# Altium project ash-power.PrjPCB (part 2 of 2)

## Sheet aux_power.SchDoc: AUX supply
size A4; Organization: GPA Robotics; DocumentNumber: 10; Revision: REV 0; SheetNumber: 10; SheetTotal: 11
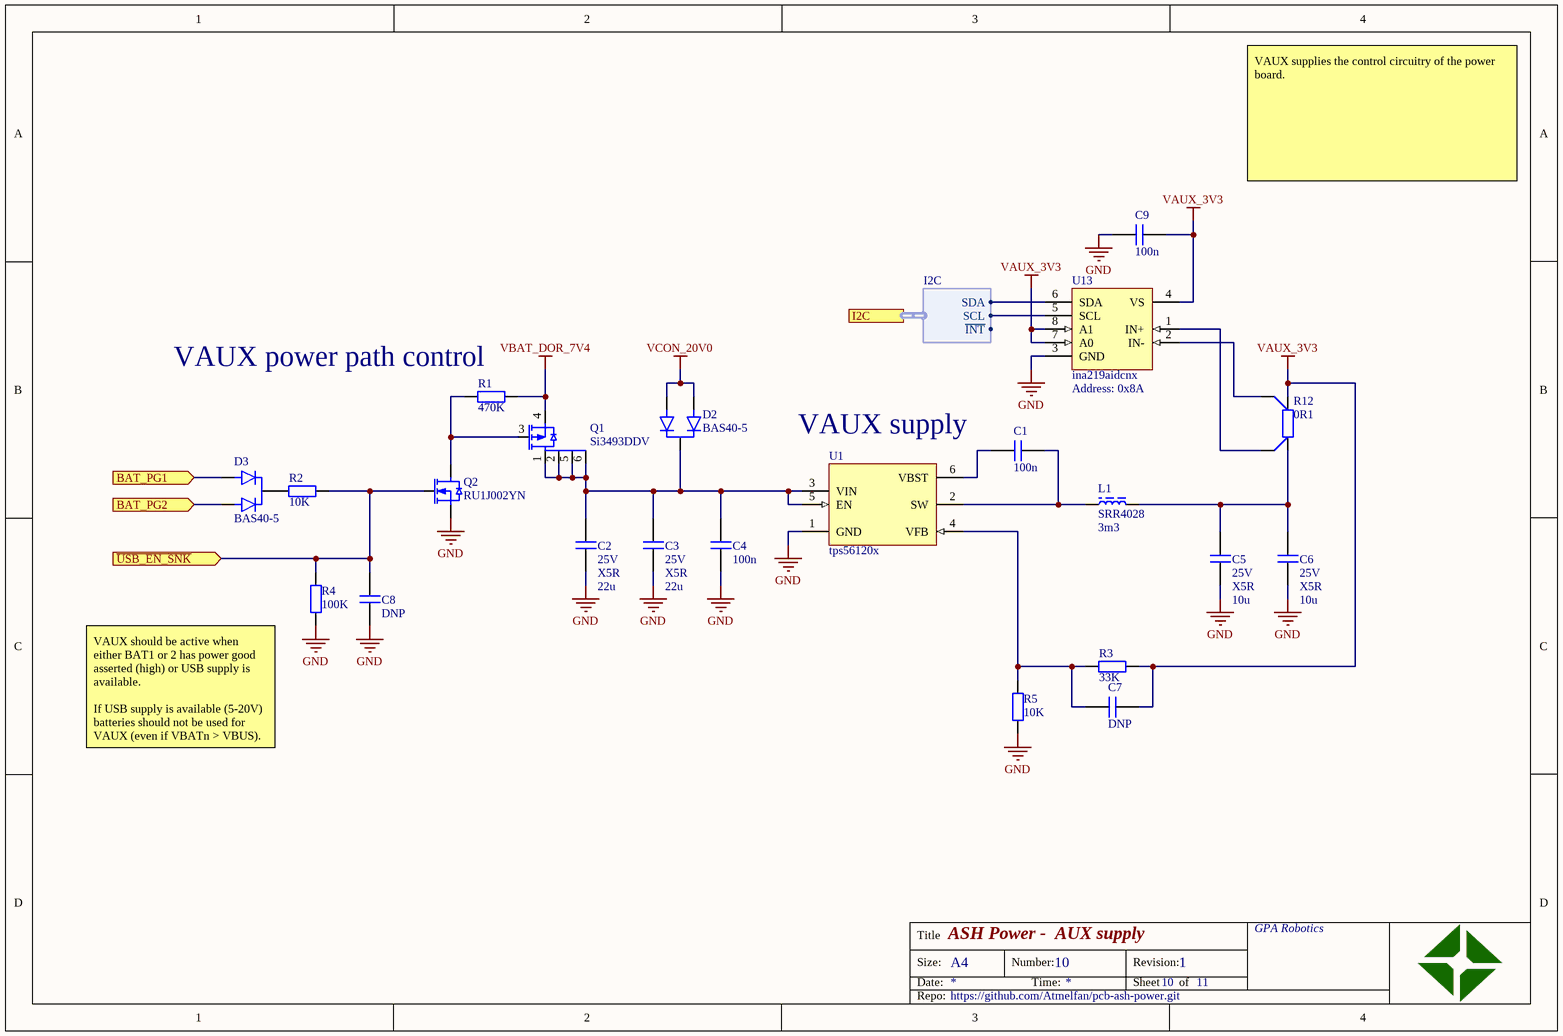
[diagram p9: aux_power.SchDoc]

### Parts
C1  value 100n  [CAPC1005X06N]  (hidden comment: cap)
C2  value 22u  voltage: 25V  type: X5R  [CAPC3216X14N]  (hidden comment: cap)
C3  value 22u  voltage: 25V  type: X5R  [CAPC3216X14N]  (hidden comment: cap)
C4  value 100n  [CAPC1005X06N]  (hidden comment: cap)
C5  value 10u  voltage: 25V  type: X5R  [CAPC3216X14N]  (hidden comment: cap)
C6  value 10u  voltage: 25V  type: X5R  [CAPC3216X14N]  (hidden comment: cap)
C7  value DNP  [CAPC1005X06N]  (hidden comment: cap)
C8  value DNP  [CAPC1005X06N]  (hidden comment: cap)
C9  value 100n  [CAPC1005X06N]  (hidden comment: cap)
D2  BAS40-5  [SOT23_CC]
D3  BAS40-5  [SOT23_CC]
L1  SRR4028  value 3m3  [SRR4028]
Q1  Si3493DDV  [SOT95P284X110-6N_TSOP6]
Q2  RU1J002YN  [SOTFL65P210X105-3N]
R1  value 470K  [RESC1005X04N]  (hidden comment: res)
R2  value 10K  [RESC1005X04N]  (hidden comment: res)
R3  value 33K  [RESC1005X04N]  (hidden comment: res)
R4  value 100K  [RESC1005X04N]  (hidden comment: res)
R5  value 10K  [RESC1005X04N]  (hidden comment: res)
R12  value 0R1  [RESC2012X06N_4T]  (hidden comment: res_4t)
U1  tps56120x  [SOT95P280X110-6N]
U13  ina219aidcnx  Address: 0x8A  [TSOP65P280X145-8N]

### Ports
BAT_PG1 (in), BAT_PG2 (in), I2C (harness I2C), ~{USB_EN_SNK} (in)

### Harnesses
I2C: SDA, SCL, ~{INT}

### Nets
GND: C2.1 C3.1 C4.1 C5.1 C6.1 C8.1 C9.2 Q2.2(S) R4.1 R5.1 U1.1(GND) U13.3(GND)
VAUX_3V3: C7.2 C9.1 R3.2 R12.1 U13.4(VS) U13.7(A0) U13.8(A1)
VBAT_DOR_7V4: Q1.4(S) R1.2
VCON_20V0: D2.A1 D2.A2  [project net VBUS]
NetC1_1: C1.1 U1.6(VBST)
NetC1_2: C1.2 L1.1 U1.2(SW)
NetC2_2: C2.2 C3.2 C4.2 D2.C Q1.1(D) Q1.2(D) Q1.5(D) Q1.6(D) U1.3(VIN) U1.5(EN)
NetC5_2: C5.2 C6.2 L1.2 R12.2
NetC7_1: C7.1 R3.1 R5.2 U1.4(VFB)
NetC8_2: C8.2 Q2.1(G) R2.2 R4.2 ; port ~{USB_EN_SNK}
NetD3_A1: D3.A1 ; port BAT_PG1
NetD3_A2: D3.A2 ; port BAT_PG2
NetD3_C: D3.C R2.1
NetID3_CONTROL_POW_LEG_L_LEG1_2: U13.5(SCL) ; port I2C.SCL
NetID4_CONTROL_POW_LEG_L_LEG1_2: U13.6(SDA) ; port I2C.SDA
NetQ1_3: Q1.3(G) Q2.3(D) R1.1
NetR12_3: R12.3 U13.2(IN-)
NetR12_4: R12.4 U13.1(IN+)

### Notes on the sheet
- VAUX supplies the control circuitry of the power board.
- (near R1) VAUX power path control
- VAUX supply
- (near R4) VAUX should be active when either BAT1 or 2 has power good asserted (high) or USB supply is available.
  If USB supply is available (5-20V) batteries should not be used for VAUX (even if VBATn > VBUS).
- Title
- Size:
- Date:
- A4
- Number:
- Time:
- Revision:
- Sheet
- of
- Repo:

### Library data of the parts
C1-C9 = cap: Capacitor; #digikey: *; #mouser: *
  C1 C4 C7-C9: voltage: *; type: *
D2 D3 = diode_dual_cc: Diode Common Cathode
Q1 = si3493ddv: P-Channel 20 V (D-S) MOSFET; ComponentLink1Description: datasheet; ComponentLink1URL: http://www.vishay.com/docs/62839/si7149adp.pdf
Q2 = ru1j002yn: N-channel 50V 200mA Small signal MOSFET; ComponentLink1Description: datasheet; ComponentLink1URL: https://www.mouser.se/datasheet/2/348/ru1j002yn-e-1018335.pdf
R1-R5 = res: Resistor; power: *; voltage: *; #digikey: *; #mouser: *
R12 = res_4t: Resistor; power: *; #digikey: *; #mouser: *
U1 = tps56120x: 4.5-V to 17-V Input, 1-A Synchronous  Step-Down  Voltage  Regulator  in 6-Pin  SOT-23; #digikey: *; #mouser: *
U13 = ina219aidcnx: INA219 Zero-Drift, Bidirectional Current/Power Monitor With I2C Interface; ComponentLink1Description: Datasheet; ComponentLink1URL: https://www.ti.com/lit/ds/symlink/ina219.pdf?&ts=1589650364826; Supplier 1: Digi-Key; Supplier Part Number 1: 296-23770-1-ND
L1 = srr4028: ComponentLink1Description: series; ComponentLink1URL: https://www.bourns.com/docs/Product-Datasheets/SRR4028.pdf

## Sheet servos.SchDoc: Eye servos
size A4; Organization: GPA Robotics; DocumentNumber: 3; Revision: REV 0; SheetNumber: 3; SheetTotal: 11
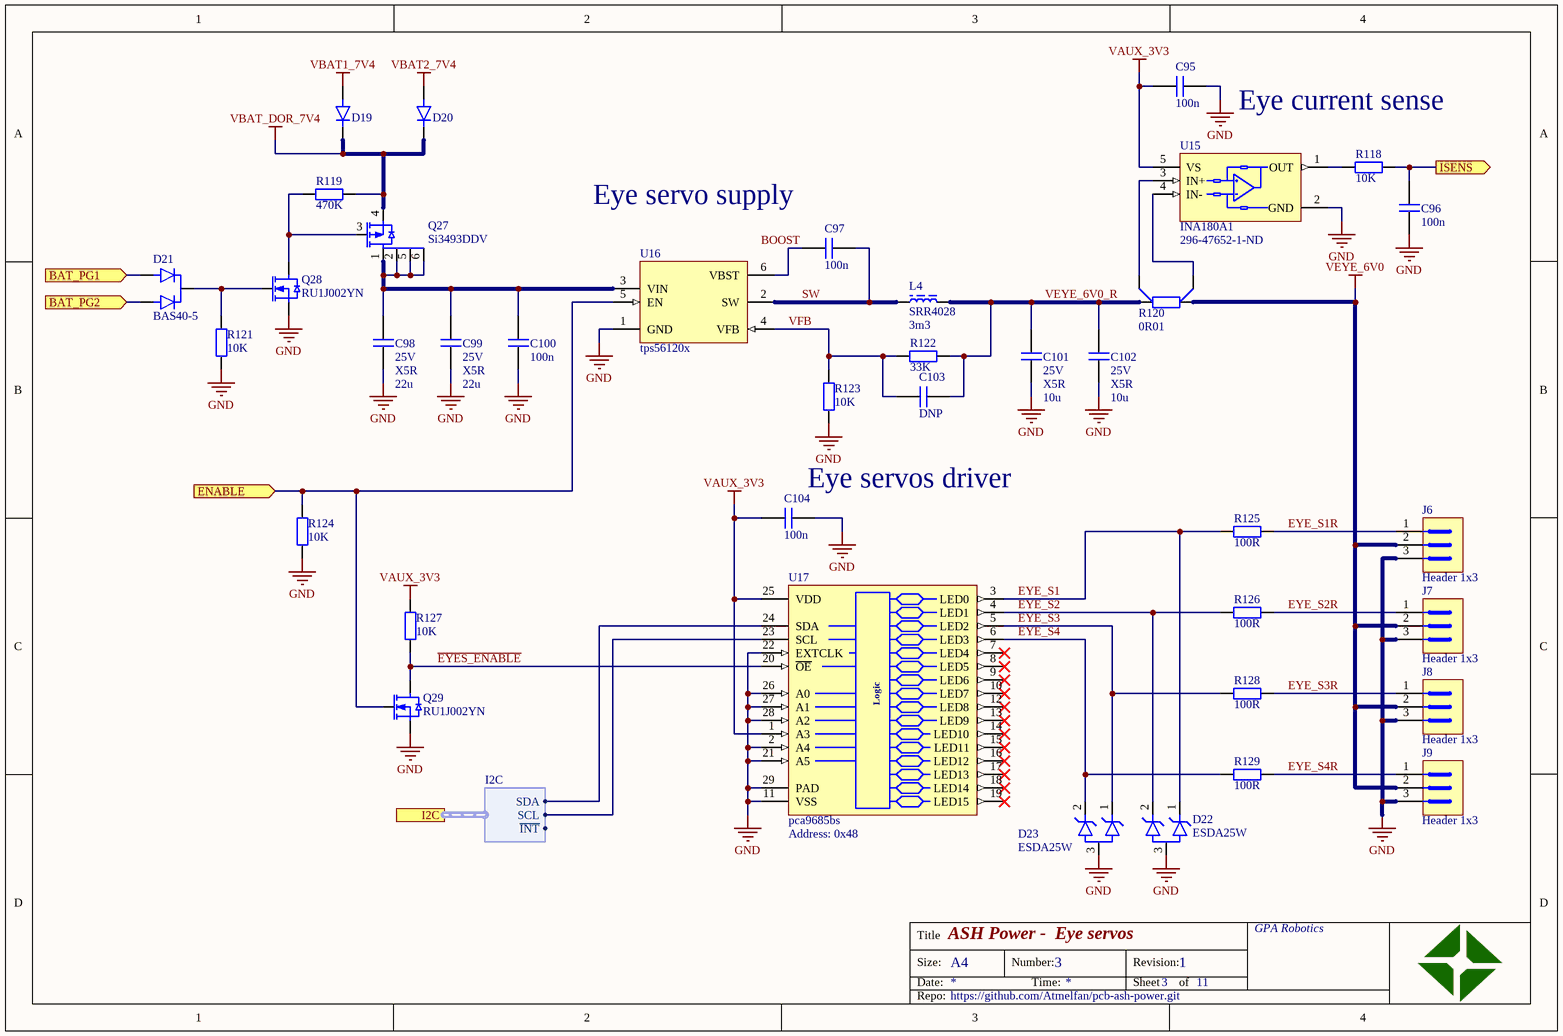
[diagram p10: servos.SchDoc]

### Parts
C95  value 100n  [CAPC1005X06N]  (hidden comment: cap)
C96  value 100n  [CAPC1005X06N]  (hidden comment: cap)
C97  value 100n  [CAPC1005X06N]  (hidden comment: cap)
C98  value 22u  voltage: 25V  type: X5R  [CAPC3216X14N]  (hidden comment: cap)
C99  value 22u  voltage: 25V  type: X5R  [CAPC3216X14N]  (hidden comment: cap)
C100  value 100n  [CAPC1005X06N]  (hidden comment: cap)
C101  value 10u  voltage: 25V  type: X5R  [CAPC3216X14N]  (hidden comment: cap)
C102  value 10u  voltage: 25V  type: X5R  [CAPC3216X14N]  (hidden comment: cap)
C103  value DNP  [CAPC1005X06N]  (hidden comment: cap)
C104  value 100n  [CAPC1005X06N]  (hidden comment: cap)
D19  DFLS2100  [SODFL370X100-2N_DFLS2100]  (value not drawn)
D20  DFLS2100  [SODFL370X100-2N_DFLS2100]  (value not drawn)
D21  BAS40-5  [SOT23_CC]
D22  ESDA25W  [SOT65P210X110-3N_SOT323-3L]
D23  ESDA25W  [SOT65P210X110-3N_SOT323-3L]
J6  Header 1x3  [HEADER_1x3_100MIL]
J7  Header 1x3  [HEADER_1x3_100MIL]
J8  Header 1x3  [HEADER_1x3_100MIL]
J9  Header 1x3  [HEADER_1x3_100MIL]
L4  SRR4028  value 3m3  [SRR4028]
Q27  Si3493DDV  [SOT95P284X110-6N_TSOP6]
Q28  RU1J002YN  [SOTFL65P210X105-3N]
Q29  RU1J002YN  [SOTFL65P210X105-3N]
R118  value 10K  [RESC1005X04N]  (hidden comment: res)
R119  value 470K  [RESC1005X04N]  (hidden comment: res)
R120  value 0R01  [4T_RESC1632X05N]  (hidden comment: res_4t)
R121  value 10K  [RESC1005X04N]  (hidden comment: res)
R122  value 33K  [RESC1005X04N]  (hidden comment: res)
R123  value 10K  [RESC1005X04N]  (hidden comment: res)
R124  value 10K  [RESC1005X04N]  (hidden comment: res)
R125  value 100R  [RESC1005X04N]  (hidden comment: res)
R126  value 100R  [RESC1005X04N]  (hidden comment: res)
R127  value 10K  [RESC1005X04N]  (hidden comment: res)
R128  value 100R  [RESC1005X04N]  (hidden comment: res)
R129  value 100R  [RESC1005X04N]  (hidden comment: res)
U15  INA180A1  Supplier Part Number 1: 296-47652-1-ND  [SOT95P280X145-5N]
U16  tps56120x  [SOT95P280X110-6N]
U17  pca9685bs  Address: 0x48  [QFN65P600X600X100_HS-29N_PCA9685BS]

### Ports
BAT_PG1 (in), BAT_PG2 (in), ENABLE (in), I2C (harness I2C), ISENS (out)

### Harnesses
I2C: SDA, SCL, ~{INT}

### Nets
GND: C95.1 C96.1 C98.1 C99.1 C100.1 C101.1 C102.1 C104.2 D22.3 D23.3 J6.3 J7.3 J8.3 J9.3 Q28.2(S) Q29.2(S) R121.1 R123.1 R124.1 U15.2(GND) U16.1(GND) U17.2(A4) U17.11(VSS) U17.21(A5) U17.22(EXTCLK) U17.26(A0) U17.27(A1) U17.28(A2) U17.29(PAD)
VAUX_3V3: C95.2 C104.1 R127.2 U15.5(VS) U17.1(A3) U17.25(VDD)
VBAT1_7V4: D19.A
VBAT2_7V4: D20.A
VBAT_DOR_7V4: D19.C D20.C Q27.4(S) R119.2
VEYE_6V0: J6.2 J7.2 J8.2 J9.2 R120.2
~{EYES_ENABLE}: Q29.3(D) R127.1 U17.20(~{OE})
BOOST: C97.1 U16.6(VBST)
EYE_S1: D22.1 R125.1 U17.3(LED0)
EYE_S1R: J6.1 R125.2
EYE_S2: D22.2 R126.1 U17.4(LED1)
EYE_S2R: J7.1 R126.2
EYE_S3: D23.1 R128.1 U17.5(LED2)
EYE_S3R: J8.1 R128.2
EYE_S4: D23.2 R129.1 U17.6(LED3)
EYE_S4R: J9.1 R129.2
SW: C97.2 L4.1 U16.2(SW)
VEYE_6V0_R: C101.2 C102.2 C103.2 L4.2 R120.1 R122.2
VFB: C103.1 R122.1 R123.2 U16.4(VFB)
NetC96_2: C96.2 R118.2 ; port ISENS
NetC98_2: C98.2 C99.2 C100.2 Q27.1(D) Q27.2(D) Q27.5(D) Q27.6(D) U16.3(VIN)
NetD3_A1: D21.A1 ; port BAT_PG1
NetD3_A2: D21.A2 ; port BAT_PG2
NetD21_C: D21.C Q28.1(G) R121.2
NetID3_CONTROL_POW_LEG_L_LEG1_2: U17.23(SCL) ; port I2C.SCL
NetID4_CONTROL_POW_LEG_L_LEG1_2: U17.24(SDA) ; port I2C.SDA
NetQ27_3: Q27.3(G) Q28.3(D) R119.1
NetQ29_1: Q29.1(G) R124.2 U16.5(EN) ; port ENABLE
NetR118_1: R118.1 U15.1(OUT)
NetR120_3: R120.3 U15.3(IN+)
NetR120_4: R120.4 U15.4(IN-)

Not connected (* = marked no-connect by the designer): U17 7(LED4)* 8(LED5)* 9(LED6)* 10(LED7)* 12(LED8)* 13(LED9)* 14(LED10)* 15(LED11)* 16(LED12)* 17(LED13)* 18(LED14)* 19(LED15)*

### Notes on the sheet
- Eye current sense
- Eye servo supply
- (near C104) Eye servos driver
- Title
- Size:
- Date:
- A4
- Number:
- Time:
- Revision:
- Sheet
- of
- Repo:
- (in symbol pca9685bs) Logic

### Library data of the parts
C95-C104 = cap: Capacitor; #digikey: *; #mouser: *
  C95-C97 C100 C103 C104: voltage: *; type: *
D19 D20 = dfls2100: 2.0A HIGH VOLTAGE SCHOTTKY BARRIER RECTIFIER; ComponentLink1Description: datasheet; ComponentLink1URL: https://www.diodes.com/assets/Datasheets/ds31475.pdf
D21 = diode_dual_cc: Diode Common Cathode
D22 D23 = esda25w: TRANSIL array for data protection; ComponentLink1Description: datasheet; ComponentLink1URL: https://www.st.com/content/ccc/resource/technical/document/datasheet/cd/9b/8d/39/1f/d4/43/ba/CD00064033.pdf/files/CD00064033.pdf/jcr:content/translations/en.CD00064033.pdf
J6-J9 = header_1x3_100mil: 2.54mm pitch single row header
Q27 = si3493ddv: P-Channel 20 V (D-S) MOSFET; ComponentLink1Description: datasheet; ComponentLink1URL: http://www.vishay.com/docs/62839/si7149adp.pdf
Q28 Q29 = ru1j002yn: N-channel 50V 200mA Small signal MOSFET; ComponentLink1Description: datasheet; ComponentLink1URL: https://www.mouser.se/datasheet/2/348/ru1j002yn-e-1018335.pdf
R118 R119 R121-R129 = res: Resistor; power: *; voltage: *; #digikey: *; #mouser: *
R120 = res_4t: Resistor; power: *; #digikey: *; #mouser: *
U15 = ina180a1: Low- and High-Side Voltage Output, Current-Sense Amplifiers; Datasheet: http://www.ti.com/lit/ds/symlink/ina180.pdf; #digikey: *; #mouser: *; Supplier 1: Digi-Key
U16 = tps56120x: 4.5-V to 17-V Input, 1-A Synchronous  Step-Down  Voltage  Regulator  in 6-Pin  SOT-23; #digikey: *; #mouser: *
U17 = pca9685bs: 16-channel, 12-bit PWM Fm+ I2C-bus LED controller; ComponentLink1Description: datasheet; ComponentLink1URL: https://www.nxp.com/docs/en/data-sheet/PCA9685.pdf
L4 = srr4028: ComponentLink1Description: series; ComponentLink1URL: https://www.bourns.com/docs/Product-Datasheets/SRR4028.pdf

## Nets that join several sheets
GND: cover (6 pins), control (23 pins), power (17 pins), ext_power (18 pins), CONTROL/POW/HS_R (16 pins), CONTROL/POW/HS_L (16 pins), usbpd_input (16 pins), CONTROL/POW/LEG_R (JG1_LEG_R.2 JG2_LEG_R.2), CONTROL/POW/LEG_R/LEG1 (25 pins), CONTROL/POW/LEG_R/LEG2 (25 pins), CONTROL/POW/LEG_R/LEG3 (25 pins), CONTROL/POW/LEG_R/LEG4 (25 pins), CONTROL/POW/LEG_L (JG1_LEG_L.2 JG2_LEG_L.2), CONTROL/POW/LEG_L/LEG1 (25 pins), CONTROL/POW/LEG_L/LEG2 (25 pins), CONTROL/POW/LEG_L/LEG3 (25 pins), CONTROL/POW/LEG_L/LEG4 (25 pins), CONTROL/POW/REG_R (29 pins), CONTROL/POW/REG_L (29 pins), aux_power (12 pins), servos (29 pins)
VAUX_3V3: control (21 pins), power (6 pins), CONTROL/POW/LEG_R/LEG1 (11 pins), CONTROL/POW/LEG_R/LEG2 (11 pins), CONTROL/POW/LEG_R/LEG3 (11 pins), CONTROL/POW/LEG_R/LEG4 (11 pins), CONTROL/POW/LEG_L/LEG1 (11 pins), CONTROL/POW/LEG_L/LEG2 (11 pins), CONTROL/POW/LEG_L/LEG3 (11 pins), CONTROL/POW/LEG_L/LEG4 (11 pins), CONTROL/POW/REG_R (C78_REG_R.2 R10_REG_R.2 U2_REG_R.4), CONTROL/POW/REG_L (C78_REG_L.2 R10_REG_L.2 U2_REG_L.4), aux_power (7 pins), servos (6 pins)
VBAT1_7V4: power (P2.1 R13.1), servos (D19.A)
VBAT2_7V4: power (P3.1 R15.1), servos (D20.A)
VBAT_DOR_7V4: aux_power (Q1.4 R1.2), servos (D19.C D20.C Q27.4 R119.2)
VBUS: usbpd_input (11 pins), aux_power (D2.A1 D2.A2)
NetC105_REG_L_1: CONTROL/POW/LEG_R/LEG1 (U6_CONTROL_POW_LEG_R_LEG1.17), CONTROL/POW/LEG_R/LEG2 (U6_CONTROL_POW_LEG_R_LEG2.17), CONTROL/POW/LEG_R/LEG3 (U6_CONTROL_POW_LEG_R_LEG3.17), CONTROL/POW/LEG_R/LEG4 (U6_CONTROL_POW_LEG_R_LEG4.17), CONTROL/POW/LEG_L/LEG1 (U6_CONTROL_POW_LEG_L_LEG1.17), CONTROL/POW/LEG_L/LEG2 (U6_CONTROL_POW_LEG_L_LEG2.17), CONTROL/POW/LEG_L/LEG3 (U6_CONTROL_POW_LEG_L_LEG3.17), CONTROL/POW/LEG_L/LEG4 (U6_CONTROL_POW_LEG_L_LEG4.17), CONTROL/POW/REG_R (C105_REG_R.1 R108_REG_R.2 U14_REG_R.17), CONTROL/POW/REG_L (C105_REG_L.1 R108_REG_L.2 U14_REG_L.17)
NetD3_A1: aux_power (D3.A1), servos (D21.A1)
NetD3_A2: aux_power (D3.A2), servos (D21.A2)
NetD12_A2: ext_power (D12.A2 R7.1 U10.8), usbpd_input (U12.14)
NetID3_CONTROL_POW_LEG_L_LEG1_2: power (U9.13), usbpd_input (U12.7), CONTROL/POW/LEG_R/LEG1 (ID3_CONTROL_POW_LEG_R_LEG1.2 U7_CONTROL_POW_LEG_R_LEG1.8 U8_CONTROL_POW_LEG_R_LEG1.6), CONTROL/POW/LEG_R/LEG2 (ID3_CONTROL_POW_LEG_R_LEG2.2 U7_CONTROL_POW_LEG_R_LEG2.8 U8_CONTROL_POW_LEG_R_LEG2.6), CONTROL/POW/LEG_R/LEG3 (ID3_CONTROL_POW_LEG_R_LEG3.2 U7_CONTROL_POW_LEG_R_LEG3.8 U8_CONTROL_POW_LEG_R_LEG3.6), CONTROL/POW/LEG_R/LEG4 (ID3_CONTROL_POW_LEG_R_LEG4.2 U7_CONTROL_POW_LEG_R_LEG4.8 U8_CONTROL_POW_LEG_R_LEG4.6), CONTROL/POW/LEG_L/LEG1 (ID3_CONTROL_POW_LEG_L_LEG1.2 U7_CONTROL_POW_LEG_L_LEG1.8 U8_CONTROL_POW_LEG_L_LEG1.6), CONTROL/POW/LEG_L/LEG2 (ID3_CONTROL_POW_LEG_L_LEG2.2 U7_CONTROL_POW_LEG_L_LEG2.8 U8_CONTROL_POW_LEG_L_LEG2.6), CONTROL/POW/LEG_L/LEG3 (ID3_CONTROL_POW_LEG_L_LEG3.2 U7_CONTROL_POW_LEG_L_LEG3.8 U8_CONTROL_POW_LEG_L_LEG3.6), CONTROL/POW/LEG_L/LEG4 (ID3_CONTROL_POW_LEG_L_LEG4.2 U7_CONTROL_POW_LEG_L_LEG4.8 U8_CONTROL_POW_LEG_L_LEG4.6), CONTROL/POW/REG_R (U2_REG_R.5), CONTROL/POW/REG_L (U2_REG_L.5), aux_power (U13.5), servos (U17.23)
NetID4_CONTROL_POW_LEG_L_LEG1_2: power (U9.12), usbpd_input (U12.8), CONTROL/POW/LEG_R/LEG1 (ID4_CONTROL_POW_LEG_R_LEG1.2 U7_CONTROL_POW_LEG_R_LEG1.9 U8_CONTROL_POW_LEG_R_LEG1.7), CONTROL/POW/LEG_R/LEG2 (ID4_CONTROL_POW_LEG_R_LEG2.2 U7_CONTROL_POW_LEG_R_LEG2.9 U8_CONTROL_POW_LEG_R_LEG2.7), CONTROL/POW/LEG_R/LEG3 (ID4_CONTROL_POW_LEG_R_LEG3.2 U7_CONTROL_POW_LEG_R_LEG3.9 U8_CONTROL_POW_LEG_R_LEG3.7), CONTROL/POW/LEG_R/LEG4 (ID4_CONTROL_POW_LEG_R_LEG4.2 U7_CONTROL_POW_LEG_R_LEG4.9 U8_CONTROL_POW_LEG_R_LEG4.7), CONTROL/POW/LEG_L/LEG1 (ID4_CONTROL_POW_LEG_L_LEG1.2 U7_CONTROL_POW_LEG_L_LEG1.9 U8_CONTROL_POW_LEG_L_LEG1.7), CONTROL/POW/LEG_L/LEG2 (ID4_CONTROL_POW_LEG_L_LEG2.2 U7_CONTROL_POW_LEG_L_LEG2.9 U8_CONTROL_POW_LEG_L_LEG2.7), CONTROL/POW/LEG_L/LEG3 (ID4_CONTROL_POW_LEG_L_LEG3.2 U7_CONTROL_POW_LEG_L_LEG3.9 U8_CONTROL_POW_LEG_L_LEG3.7), CONTROL/POW/LEG_L/LEG4 (ID4_CONTROL_POW_LEG_L_LEG4.2 U7_CONTROL_POW_LEG_L_LEG4.9 U8_CONTROL_POW_LEG_L_LEG4.7), CONTROL/POW/REG_R (U2_REG_R.6), CONTROL/POW/REG_L (U2_REG_L.6), aux_power (U13.6), servos (U17.24)
NetQ11_HS_L_5: CONTROL/POW/HS_R (9 pins), CONTROL/POW/HS_L (9 pins)
NetQ13_HS_L_3: CONTROL/POW/HS_R (Q13_HS_R.3 R50_HS_R.1 R52_HS_R.2 U5_HS_R.8), CONTROL/POW/HS_L (Q13_HS_L.3 R50_HS_L.1 R52_HS_L.2 U5_HS_L.8)
NetQ14_HS_L_5: CONTROL/POW/HS_R (7 pins), CONTROL/POW/HS_L (7 pins)
NetQ24_1: power (U9.3), usbpd_input (Q24.1)
NetR58_HS_L_1: CONTROL/POW/HS_R (R58_HS_R.1 U5_HS_R.17), CONTROL/POW/HS_L (R58_HS_L.1 U5_HS_L.17)
NetR103_2: power (U9.11), usbpd_input (R103.2), CONTROL/POW/LEG_R/LEG1 (U8_CONTROL_POW_LEG_R_LEG1.9), CONTROL/POW/LEG_R/LEG2 (U8_CONTROL_POW_LEG_R_LEG2.9), CONTROL/POW/LEG_R/LEG3 (U8_CONTROL_POW_LEG_R_LEG3.9), CONTROL/POW/LEG_R/LEG4 (U8_CONTROL_POW_LEG_R_LEG4.9), CONTROL/POW/LEG_L/LEG1 (U8_CONTROL_POW_LEG_L_LEG1.9), CONTROL/POW/LEG_L/LEG2 (U8_CONTROL_POW_LEG_L_LEG2.9), CONTROL/POW/LEG_L/LEG3 (U8_CONTROL_POW_LEG_L_LEG3.9), CONTROL/POW/LEG_L/LEG4 (U8_CONTROL_POW_LEG_L_LEG4.9)
NetU5_HS_L_11: CONTROL/POW/HS_R (U5_HS_R.11), CONTROL/POW/HS_L (U5_HS_L.11)
NetU5_HS_L_18: CONTROL/POW/HS_R (U5_HS_R.18), CONTROL/POW/HS_L (U5_HS_L.18)
NetU8_CONTROL_POW_LEG_L_LEG1_8: CONTROL/POW/LEG_R/LEG1 (U8_CONTROL_POW_LEG_R_LEG1.8 U8_CONTROL_POW_LEG_R_LEG1.10), CONTROL/POW/LEG_R/LEG2 (U8_CONTROL_POW_LEG_R_LEG2.8 U8_CONTROL_POW_LEG_R_LEG2.10), CONTROL/POW/LEG_R/LEG3 (U8_CONTROL_POW_LEG_R_LEG3.8 U8_CONTROL_POW_LEG_R_LEG3.10), CONTROL/POW/LEG_R/LEG4 (U8_CONTROL_POW_LEG_R_LEG4.8 U8_CONTROL_POW_LEG_R_LEG4.10), CONTROL/POW/LEG_L/LEG1 (U8_CONTROL_POW_LEG_L_LEG1.8 U8_CONTROL_POW_LEG_L_LEG1.10), CONTROL/POW/LEG_L/LEG2 (U8_CONTROL_POW_LEG_L_LEG2.8 U8_CONTROL_POW_LEG_L_LEG2.10), CONTROL/POW/LEG_L/LEG3 (U8_CONTROL_POW_LEG_L_LEG3.8 U8_CONTROL_POW_LEG_L_LEG3.10), CONTROL/POW/LEG_L/LEG4 (U8_CONTROL_POW_LEG_L_LEG4.8 U8_CONTROL_POW_LEG_L_LEG4.10)
NetU14_REG_L_9: CONTROL/POW/REG_R (U14_REG_R.9), CONTROL/POW/REG_L (U14_REG_L.9)
NetU18_CONTROL_POW_LEG_L_LEG1_2: CONTROL/POW/LEG_R/LEG1 (U18_CONTROL_POW_LEG_R_LEG1.2), CONTROL/POW/LEG_R/LEG2 (U18_CONTROL_POW_LEG_R_LEG2.2), CONTROL/POW/LEG_R/LEG3 (U18_CONTROL_POW_LEG_R_LEG3.2), CONTROL/POW/LEG_R/LEG4 (U18_CONTROL_POW_LEG_R_LEG4.2), CONTROL/POW/LEG_L/LEG1 (U18_CONTROL_POW_LEG_L_LEG1.2), CONTROL/POW/LEG_L/LEG2 (U18_CONTROL_POW_LEG_L_LEG2.2), CONTROL/POW/LEG_L/LEG3 (U18_CONTROL_POW_LEG_L_LEG3.2), CONTROL/POW/LEG_L/LEG4 (U18_CONTROL_POW_LEG_L_LEG4.2)
NetU18_CONTROL_POW_LEG_L_LEG1_5: CONTROL/POW/LEG_R/LEG1 (U18_CONTROL_POW_LEG_R_LEG1.5), CONTROL/POW/LEG_R/LEG2 (U18_CONTROL_POW_LEG_R_LEG2.5), CONTROL/POW/LEG_R/LEG3 (U18_CONTROL_POW_LEG_R_LEG3.5), CONTROL/POW/LEG_R/LEG4 (U18_CONTROL_POW_LEG_R_LEG4.5), CONTROL/POW/LEG_L/LEG1 (U18_CONTROL_POW_LEG_L_LEG1.5), CONTROL/POW/LEG_L/LEG2 (U18_CONTROL_POW_LEG_L_LEG2.5), CONTROL/POW/LEG_L/LEG3 (U18_CONTROL_POW_LEG_L_LEG3.5), CONTROL/POW/LEG_L/LEG4 (U18_CONTROL_POW_LEG_L_LEG4.5)
NetU18_CONTROL_POW_LEG_L_LEG1_9: CONTROL/POW/LEG_R/LEG1 (U18_CONTROL_POW_LEG_R_LEG1.9), CONTROL/POW/LEG_R/LEG2 (U18_CONTROL_POW_LEG_R_LEG2.9), CONTROL/POW/LEG_R/LEG3 (U18_CONTROL_POW_LEG_R_LEG3.9), CONTROL/POW/LEG_R/LEG4 (U18_CONTROL_POW_LEG_R_LEG4.9), CONTROL/POW/LEG_L/LEG1 (U18_CONTROL_POW_LEG_L_LEG1.9), CONTROL/POW/LEG_L/LEG2 (U18_CONTROL_POW_LEG_L_LEG2.9), CONTROL/POW/LEG_L/LEG3 (U18_CONTROL_POW_LEG_L_LEG3.9), CONTROL/POW/LEG_L/LEG4 (U18_CONTROL_POW_LEG_L_LEG4.9)
SEC_OK: CONTROL/POW/HS_R (D7_HS_R.A1 U5_HS_R.21), CONTROL/POW/HS_L (D7_HS_L.A1 U5_HS_L.21)
VOUT: CONTROL/POW/HS_R (R39_HS_R.2), CONTROL/POW/HS_L (R39_HS_L.2), usbpd_input (7 pins), CONTROL/POW/REG_R (8 pins), CONTROL/POW/REG_L (8 pins)

## Assembly variants
Default: not fitted C7 C8 C39 ID1100 ID1101 ID1102 ID1103 ID1104 ID1300 ID1302 ID1303 ID1501 ID1502 ID1504 ID1703 ID1704 ID2200 ID2201 ID2202 ID2203 ID2204 ID2400 ID2402 ID2403 ID2601 ID2602 ID2604 ID2803 ID2804